# EAGLE design MainBoard_v5 (EAGLE 9.7.0)

## Sheet 1 of 3
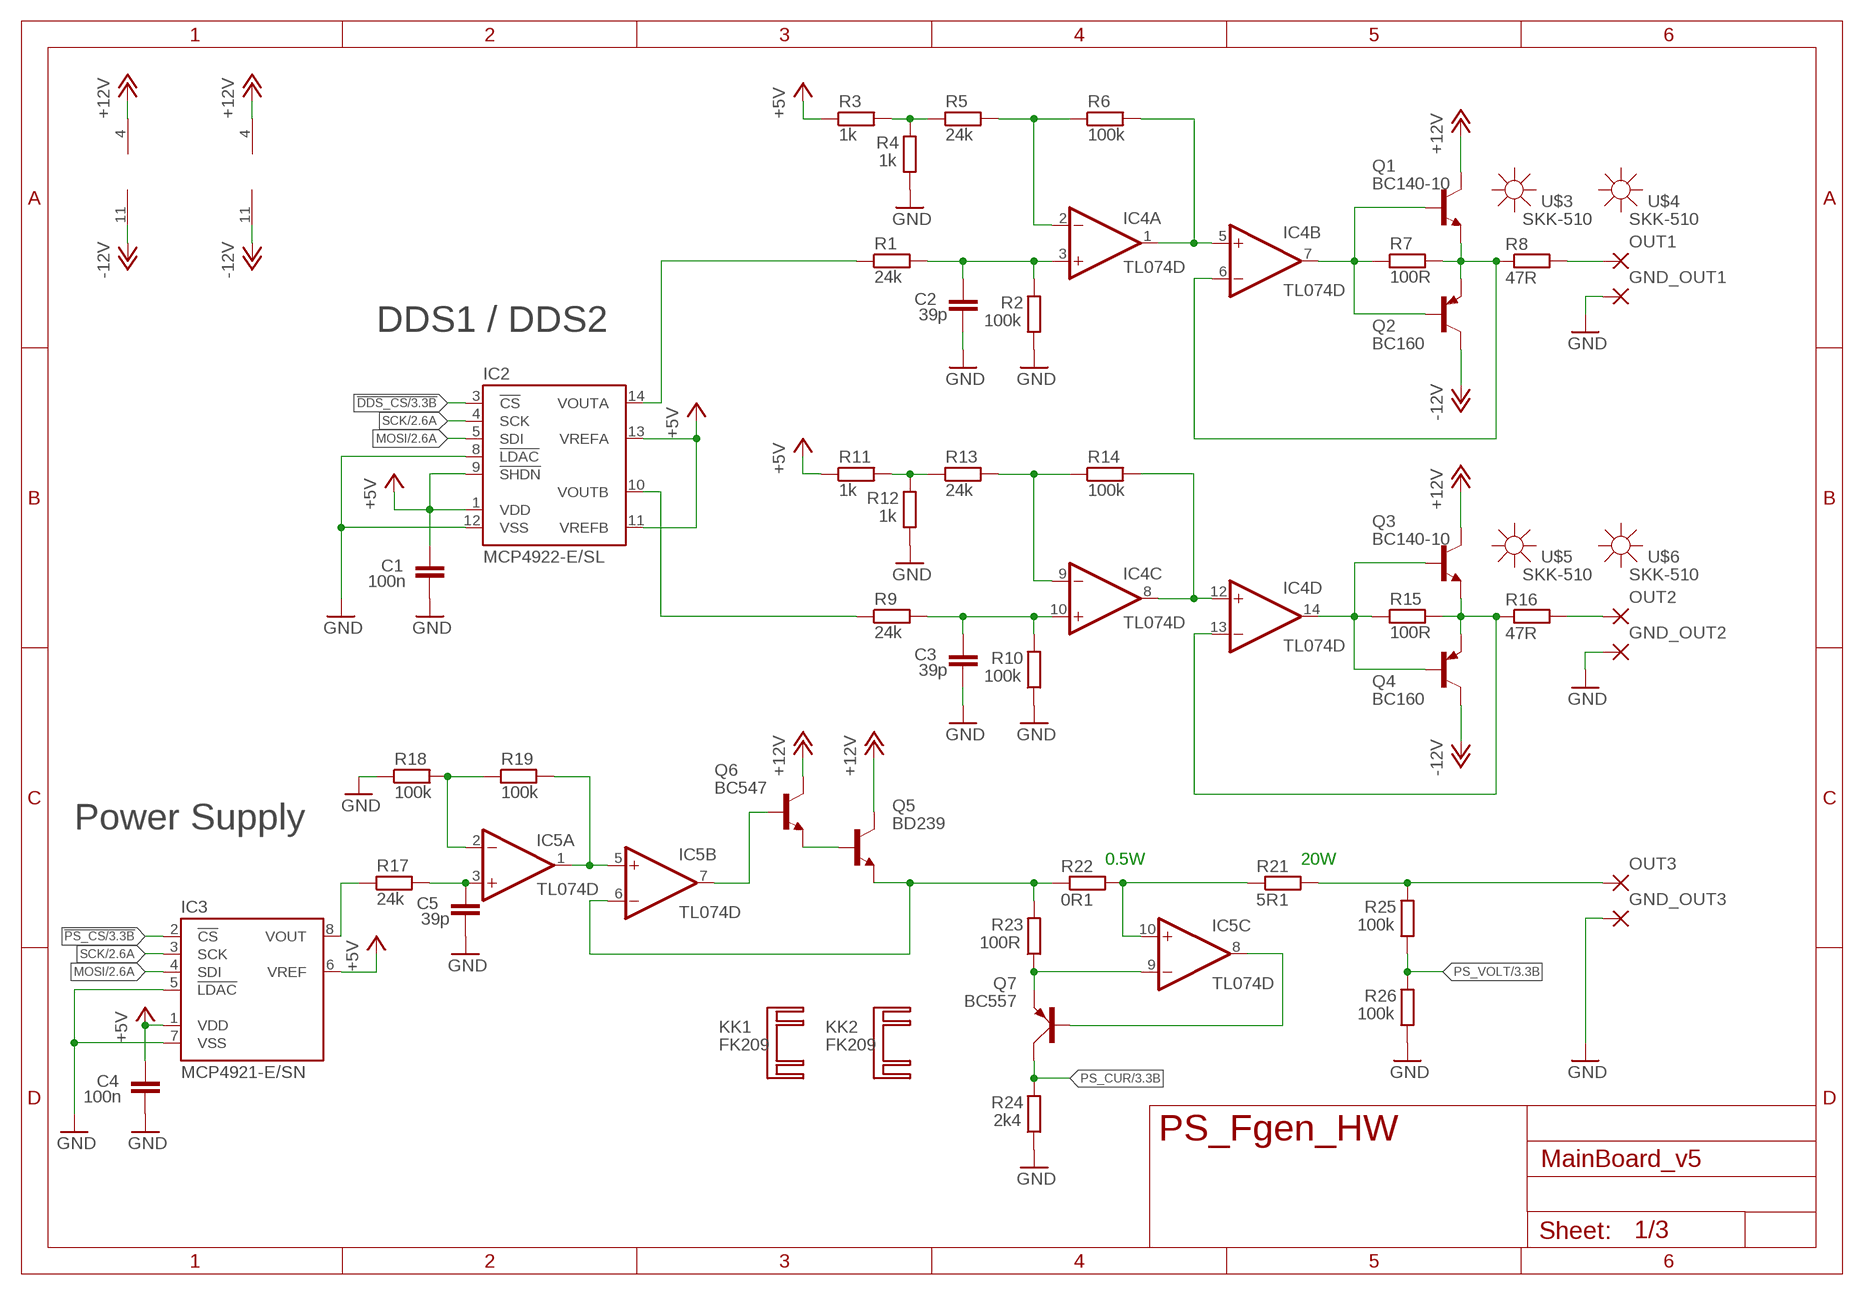
[diagram p0: schematic, sheet 1]

### Parts
C1  100n  C-EUC0805  [C0805]
C2  39p  C-EUC0805  [C0805]
C3  39p  C-EUC0805  [C0805]
C4  100n  C-EUC0805  [C0805]
C5  39p  C-EUC0805  [C0805]
GND_OUT1  2,54/1,0  [2,54/1,0]
GND_OUT2  2,54/1,0  [2,54/1,0]
GND_OUT3  2,54/1,0  [2,54/1,0]
IC2  MCP4922-E/SL  [SO14]
IC3  MCP4921-E/SN  [SO08]
IC4  TL074D  [SO14]
IC5  TL074D  [SO14]
KK1  FK209  [FK209]
KK2  FK209  [FK209]
OUT1  2,54/1,0  [2,54/1,0]
OUT2  2,54/1,0  [2,54/1,0]
OUT3  2,54/1,0  [2,54/1,0]
Q1  BC140-10  [TO39]
Q2  BC160  [TO39]
Q3  BC140-10  [TO39]
Q4  BC160  [TO39]
Q5  BD239  BD239TO220BV  [CB-274]
Q6  BC547  [TO92]
Q7  BC557  [SOT54A]
R1  24k  R-EU_R0805  [R0805]
R2  100k  R-EU_R0805  [R0805]
R3  1k  R-EU_R0805  [R0805]
R4  1k  R-EU_R0805  [R0805]
R5  24k  R-EU_R0805  [R0805]
R6  100k  R-EU_R0805  [R0805]
R7  100R  R-EU_R0805  [R0805]
R8  47R  R-EU_0411/15  [0411/15]
R9  24k  R-EU_R0805  [R0805]
R10  100k  R-EU_R0805  [R0805]
R11  1k  R-EU_R0805  [R0805]
R12  1k  R-EU_R0805  [R0805]
R13  24k  R-EU_R0805  [R0805]
R14  100k  R-EU_R0805  [R0805]
R15  100R  R-EU_R0805  [R0805]
R16  47R  R-EU_0411/15  [0411/15]
R17  24k  R-EU_R0805  [R0805]
R18  100k  R-EU_R0805  [R0805]
R19  100k  R-EU_R0805  [R0805]
R21  5R1  R-EU_0411/15  [0411/15]
R22  0R1  R-EU_0411/15  [0411/15]
R23  100R  R-EU_R0805  [R0805]
R24  2k4  R-EU_R0805  [R0805]
R25  100k  R-EU_R0805  [R0805]
R26  100k  R-EU_R0805  [R0805]
U$3  SKK-510  [SKK]
U$4  SKK-510  [SKK]
U$5  SKK-510  [SKK]
U$6  SKK-510  [SKK]

### Nets
!DDS_CS: IC2.3(!CS) ; also sheet 3
!PS_CS: IC3.2(!CS) ; also sheet 3
+5V: C1.2 C4.2 IC2.1(VDD) IC2.9(!SHDN) IC2.11(VREFB) IC2.13(VREFA) IC3.1(VDD) IC3.6(VREF) R3.1 R11.1 ; also sheet 2,3
+12V: IC4.4(P:V+) IC5.4(P:V+) Q1.3(C) Q3.3(C) Q5.T2(C) Q6.3(C) ; also sheet 2
-12V: IC4.11(P:V-) IC5.11(P:V-) Q2.3(C) Q4.3(C) ; also sheet 2
GND: C1.1 C2.1 C3.1 C4.1 C5.1 GND_OUT1.1(P) GND_OUT2.1(P) GND_OUT3.1(P) IC2.8(!LDAC) IC2.12(VSS) IC3.5(!LDAC) IC3.7(VSS) R2.1 R4.1 R10.1 R12.1 R18.1 R24.1 R26.1 ; also sheet 2,3
MOSI: IC2.5(SDI) IC3.4(SDI) ; also sheet 2,3
N$1: IC2.14(VOUTA) R1.1
N$2: C2.2 IC4.3(A:+IN) R1.2 R2.2
N$3: R3.2 R4.2 R5.1
N$4: IC4.2(A:-IN) R5.2 R6.1
N$5: IC4.7(B:OUT) Q1.2(B) Q2.2(B) R7.1
N$6: IC4.1(A:OUT) IC4.5(B:+IN) R6.2
N$7: IC4.6(B:-IN) Q1.1(E) Q2.1(E) R7.2 R8.1
N$8: R11.2 R12.2 R13.1
N$9: IC4.9(C:-IN) R13.2 R14.1
N$10: C3.2 IC4.10(C:+IN) R9.2 R10.2
N$11: IC4.8(C:OUT) IC4.12(D:+IN) R14.2
N$12: IC2.10(VOUTB) R9.1
N$13: IC4.14(D:OUT) Q3.2(B) Q4.2(B) R15.1
N$14: IC4.13(D:-IN) Q3.1(E) Q4.1(E) R15.2 R16.1
N$15: IC3.8(VOUT) R17.1
N$16: C5.2 IC5.3(A:+IN) R17.2
N$17: IC5.2(A:-IN) R18.2 R19.1
N$18: IC5.6(B:-IN) Q5.G(E) R22.1 R23.2
N$19: IC5.1(A:OUT) IC5.5(B:+IN) R19.2
N$20: Q5.T1(B) Q6.1(E)
N$22: OUT3.1(P) R21.2 R25.2
N$23: IC5.9(C:-IN) Q7.E R23.1
N$25: IC5.8(C:OUT) Q7.B
N$31: OUT2.1(P) R16.2
N$32: OUT1.1(P) R8.2
N$38: IC5.7(B:OUT) Q6.2(B)
N$39: IC5.10(C:+IN) R21.1 R22.2
PS_CUR: Q7.C R24.2 ; also sheet 3
PS_VOLT: R25.1 R26.2 ; also sheet 3
SCK: IC2.4(SCK) IC3.3(SCK) ; also sheet 2,3

### Notes on the sheet
- DDS1 / DDS2
- Power Supply
- 0.5W | 20W
- PS_Fgen_HW

## Sheet 2 of 3
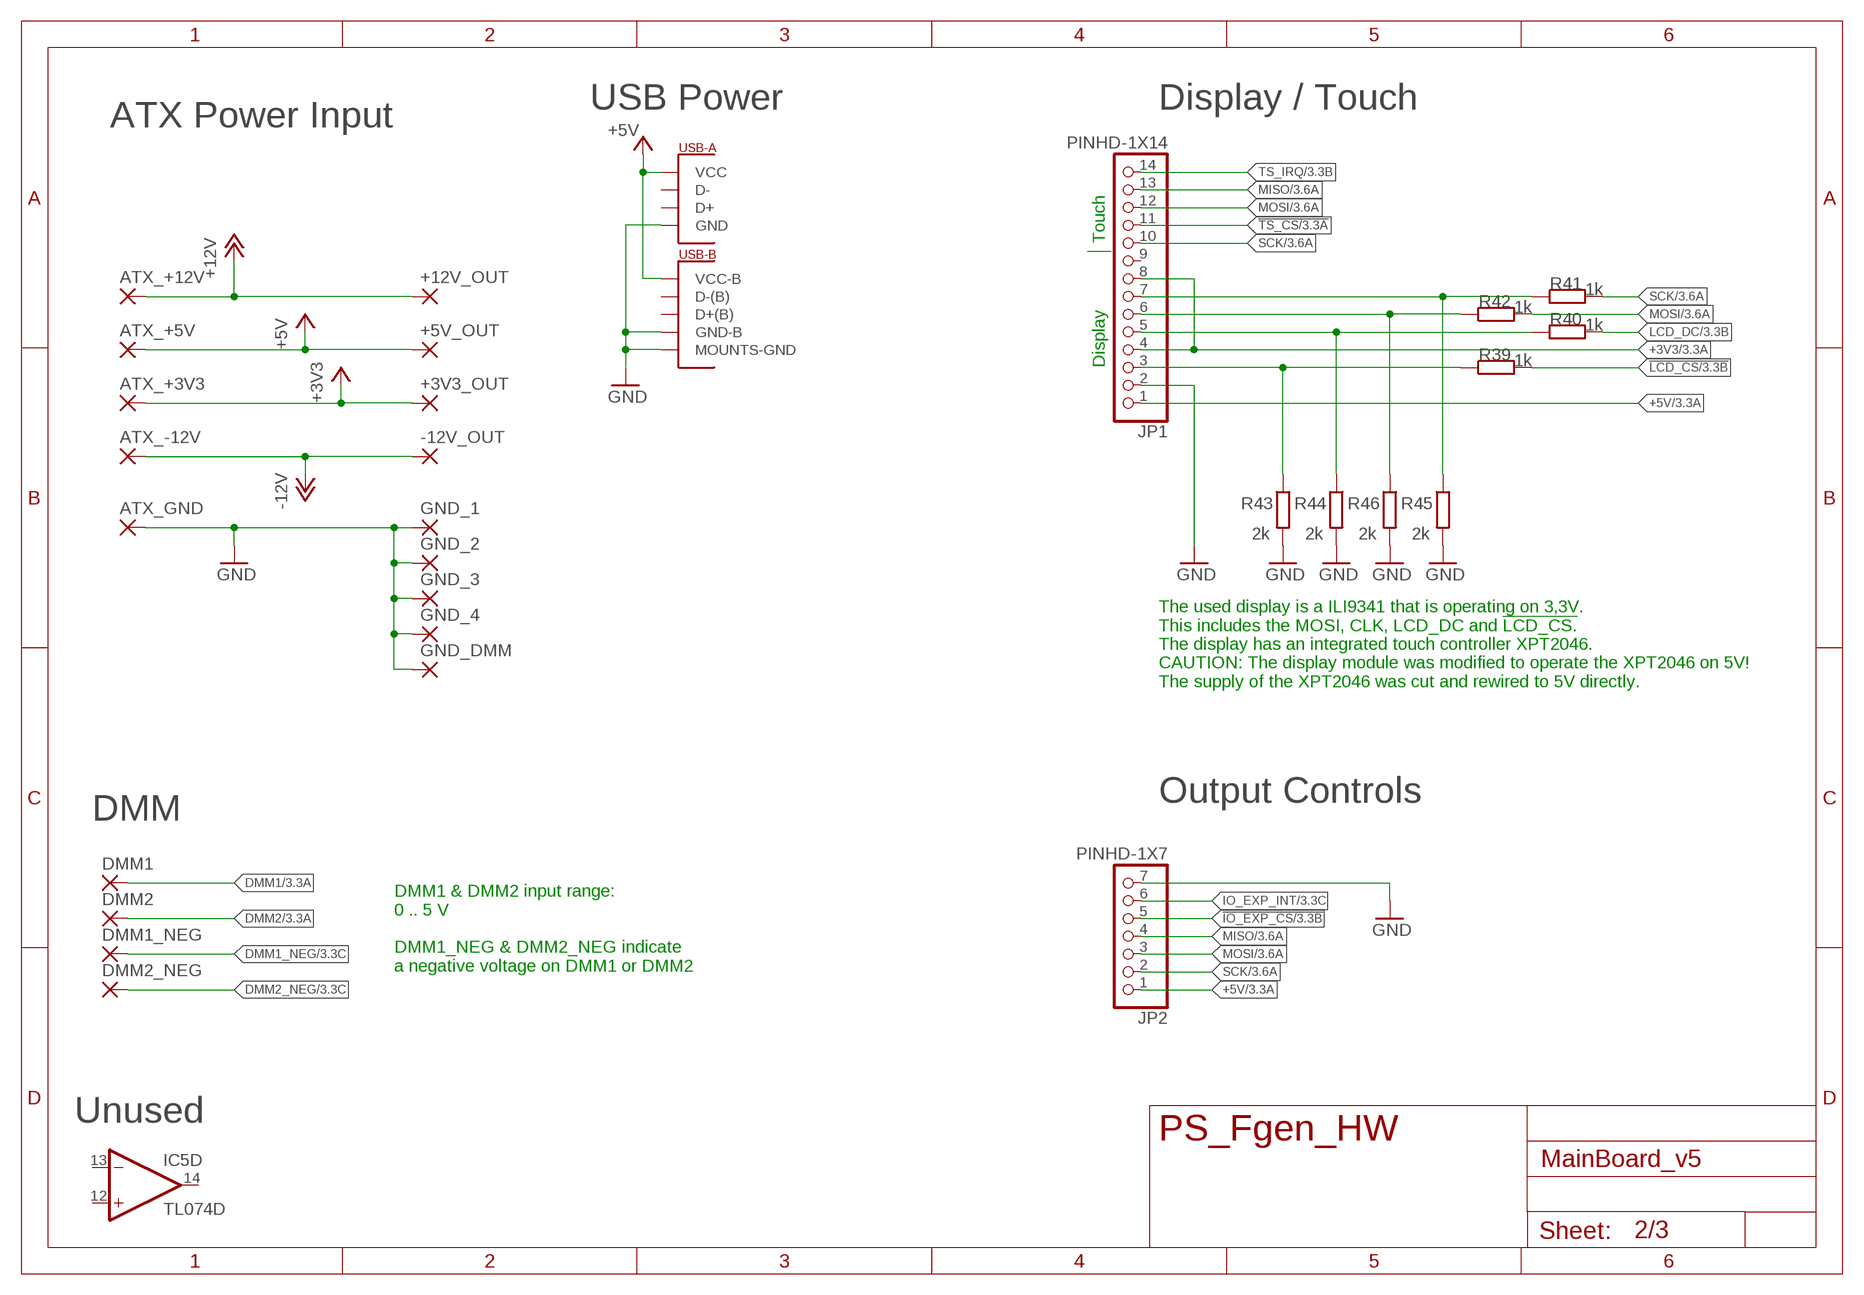
[diagram p1: schematic, sheet 2]

### Parts
+3V3_OUT  2,54/1,0  [2,54/1,0]
+5V_OUT  2,54/1,0  [2,54/1,0]
+12V_OUT  2,54/1,0  [2,54/1,0]
-12V_OUT  2,54/1,0  [2,54/1,0]
ATX_+3V3  2,54/1,0  [2,54/1,0]
ATX_+5V  2,54/1,0  [2,54/1,0]
ATX_+12V  2,54/1,0  [2,54/1,0]
ATX_-12V  2,54/1,0  [2,54/1,0]
ATX_GND  2,54/1,0  [2,54/1,0]
DMM1  2,54/1,0  [2,54/1,0]
DMM1_NEG  2,54/1,0  [2,54/1,0]
DMM2  2,54/1,0  [2,54/1,0]
DMM2_NEG  2,54/1,0  [2,54/1,0]
GND_1  2,54/1,0  [2,54/1,0]
GND_2  2,54/1,0  [2,54/1,0]
GND_3  2,54/1,0  [2,54/1,0]
GND_4  2,54/1,0  [2,54/1,0]
GND_DMM  2,54/1,0  [2,54/1,0]
JP1  PINHD-1X14  [1X14]
JP2  PINHD-1X7  [1X07]
R39  1k  R-EU_R0805  [R0805]
R40  1k  R-EU_R0805  [R0805]
R41  1k  R-EU_R0805  [R0805]
R42  1k  R-EU_R0805  [R0805]
R43  2k  R-EU_R0805  [R0805]
R44  2k  R-EU_R0805  [R0805]
R45  2k  R-EU_R0805  [R0805]
R46  2k  R-EU_R0805  [R0805]
U$2  DUAL-PORT-USB-REC  [DUAL-PORT-USB]

### Nets
!IO_EXP_CS: JP2.5 ; also sheet 3
!LCD_CS: R39.2 ; also sheet 3
!LCD_CS_3V3: JP1.3 R39.1 R43.1
!TS_CS: JP1.11 ; also sheet 3
+3V3: +3V3_OUT.1(P) ATX_+3V3.1(P) JP1.4 JP1.8 ; also sheet 3
+5V: +5V_OUT.1(P) ATX_+5V.1(P) JP1.1 JP2.1 U$2.P$10(VCC-B) U$2.P$12(VCC) ; also sheet 1,3
+12V: +12V_OUT.1(P) ATX_+12V.1(P) ; also sheet 1
-12V: -12V_OUT.1(P) ATX_-12V.1(P) ; also sheet 1
DMM1: DMM1.1(P) ; also sheet 3
DMM1_NEG: DMM1_NEG.1(P) ; also sheet 3
DMM2: DMM2.1(P) ; also sheet 3
DMM2_NEG: DMM2_NEG.1(P) ; also sheet 3
GND: ATX_GND.1(P) GND_1.1(P) GND_2.1(P) GND_3.1(P) GND_4.1(P) GND_DMM.1(P) JP1.2 JP2.7 R43.2 R44.2 R45.2 R46.2 U$2.GND(MOUNTS-GND) U$2.P$2(MOUNTS-GND) U$2.P$3(MOUNTS-GND) U$2.P$4(MOUNTS-GND) U$2.P$9(GND-B) U$2.P$11(GND) ; also sheet 1,3
IO_EXP_INT: JP2.6 ; also sheet 3
LCD_DC: R40.2 ; also sheet 3
MISO: JP1.13 JP2.4 ; also sheet 3
MOSI: JP1.12 JP2.3 R42.2 ; also sheet 1,3
MOSI_3V3: JP1.6 R42.1 R46.1
N$21: JP1.5 R40.1 R44.1
SCK: JP1.10 JP2.2 R41.2 ; also sheet 1,3
SCK_3V3: JP1.7 R41.1 R45.1
TS_IRQ: JP1.14 ; also sheet 3
Unconnected: IC5.12(D:+IN) IC5.13(D:-IN) IC5.14(D:OUT) JP1.9 U$2.P$5(D-(B)) U$2.P$6(D+(B)) U$2.P$7(D-) U$2.P$8(D+)

### Notes on the sheet
- USB Power | Display / Touch
- ATX Power Input
- Touch
- Display
- The used display is a ILI9341 that is operating on 3,3V.
  This includes the MOSI, CLK, LCD_DC and !LCD_CS.
  The display has an integrated touch controller XPT2046.
  CAUTION: The display module was modified to operate the XPT2046 on 5V!
  The supply of the XPT2046 was cut and rewired to 5V directly.
- Output Controls
- DMM
- DMM1 & DMM2 input range:
  0 .. 5 V
  
  DMM1_NEG & DMM2_NEG indicate
  a negative voltage on DMM1 or DMM2
- Unused
- PS_Fgen_HW

## Sheet 3 of 3
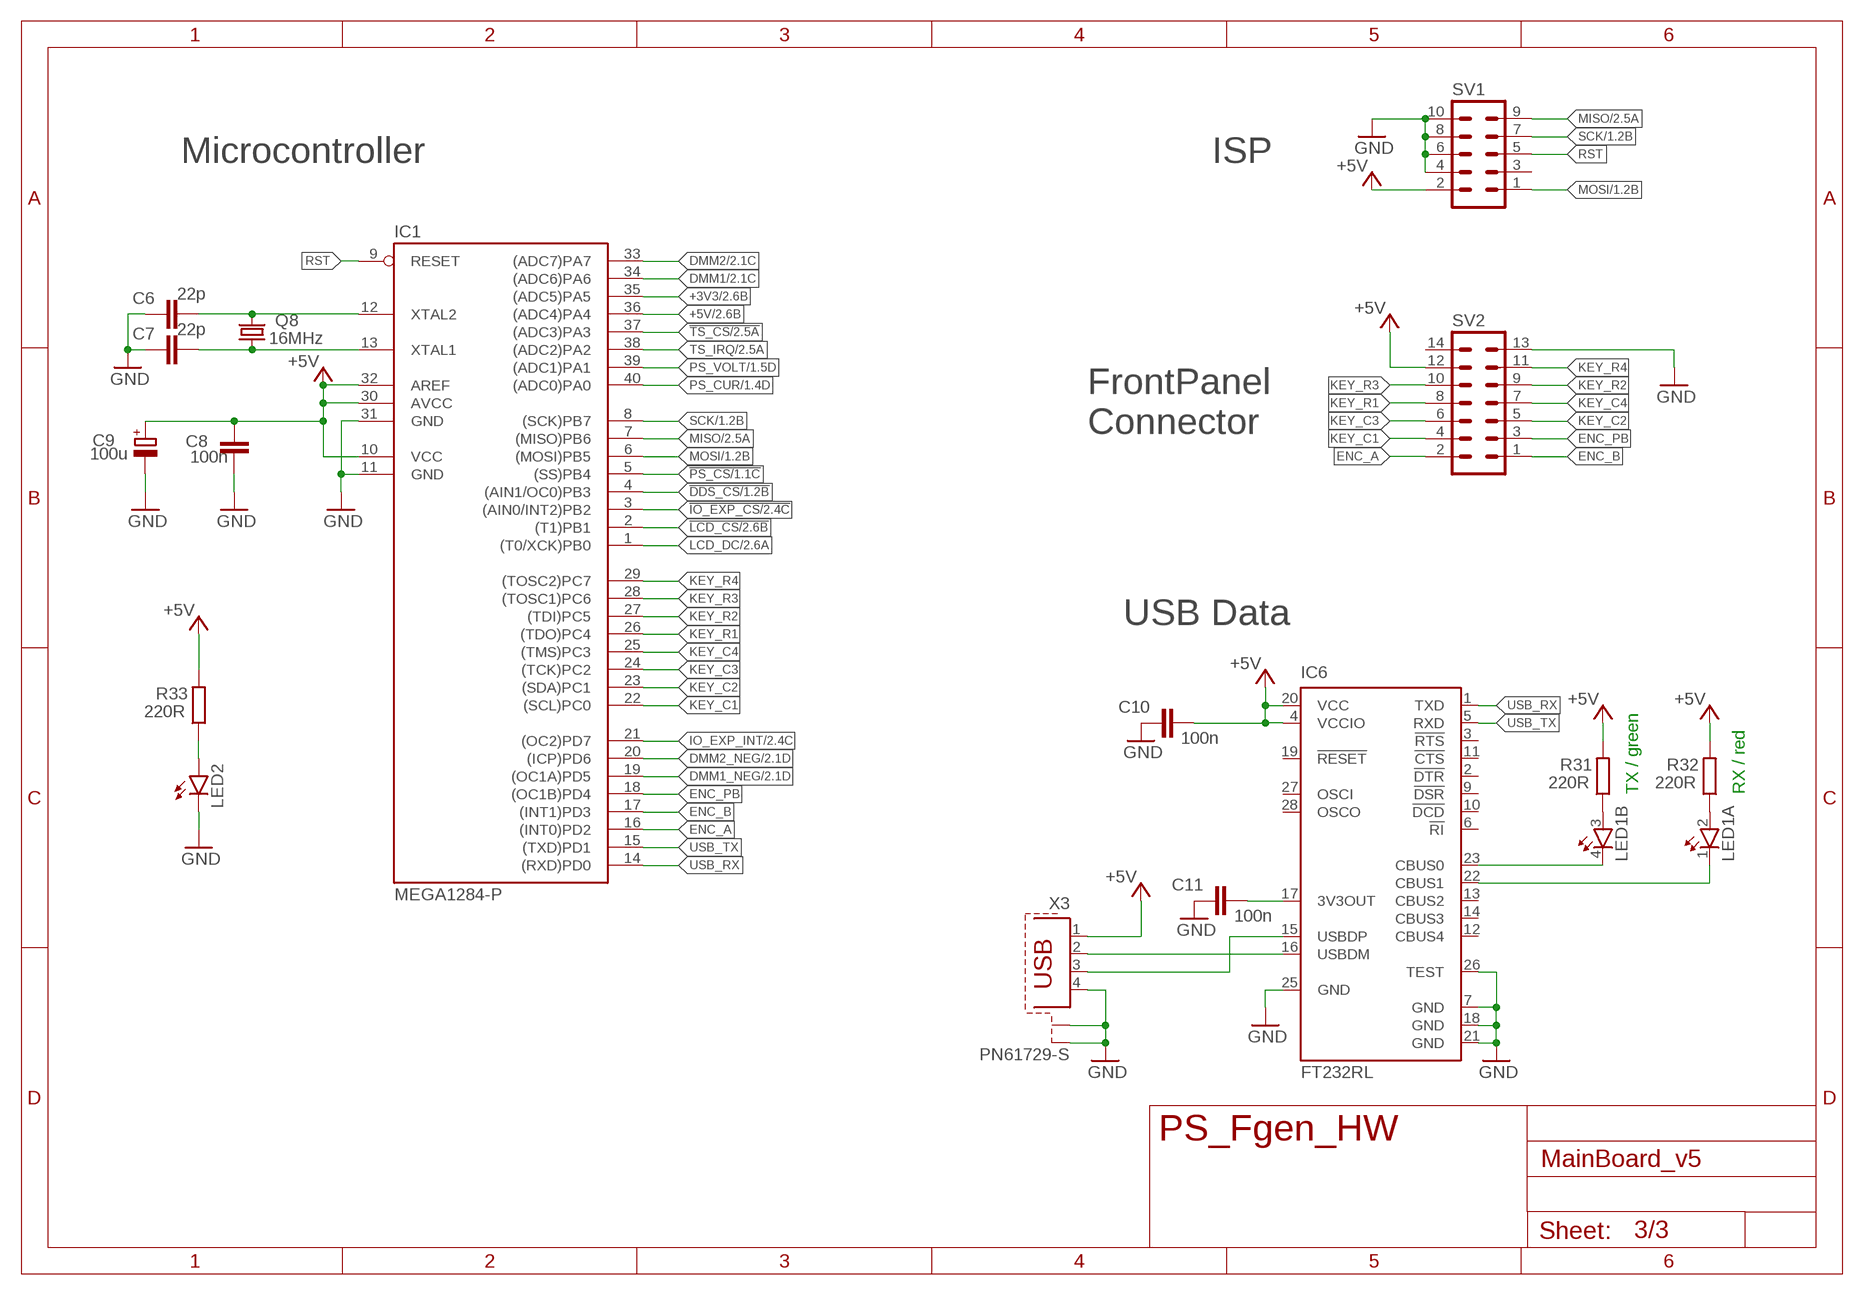
[diagram p2: schematic, sheet 3]

### Parts
C6  22p  C-EUC0805  [C0805]
C7  22p  C-EUC0805  [C0805]
C8  100n  C-EUC0805  [C0805]
C9  100u  CPOL-EUD  [PANASONIC_D]
C10  100n  C-EUC0805  [C0805]
C11  100n  C-EUC0805  [C0805]
IC1  MEGA1284-P  MEGA16-P  [DIL40]
IC6  FT232RL  [SSOP28]
LED1  TOPLED-2--  [P-LCC-4-2]
LED2  LEDCHIP-LED0805  [CHIP-LED0805]
Q8  16MHz  CRYSTALHC49S  [HC49/S]
R31  220R  R-EU_R0805  [R0805]
R32  220R  R-EU_R0805  [R0805]
R33  220R  R-EU_R0805  [R0805]
SV1  ML10  [ML10]
SV2  ML14  [ML14]
X3  PN61729-S  [PN61729-S]

### Nets
!DDS_CS: IC1.4((AIN1/OC0)PB3) ; also sheet 1
!IO_EXP_CS: IC1.3((AIN0/INT2)PB2) ; also sheet 2
!LCD_CS: IC1.2((T1)PB1) ; also sheet 2
!PS_CS: IC1.5((SS)PB4) ; also sheet 1
!TS_CS: IC1.37((ADC3)PA3) ; also sheet 2
+3V3: IC1.35((ADC5)PA5) ; also sheet 2
+5V: C8.2 C9.+ C10.1 IC1.10(VCC) IC1.30(AVCC) IC1.32(AREF) IC1.36((ADC4)PA4) IC6.4(VCCIO) IC6.20(VCC) R31.2 R32.2 R33.2 SV1.2 SV2.12 X3.1 ; also sheet 1,2
DMM1: IC1.34((ADC6)PA6) ; also sheet 2
DMM1_NEG: IC1.19((OC1A)PD5) ; also sheet 2
DMM2: IC1.33((ADC7)PA7) ; also sheet 2
DMM2_NEG: IC1.20((ICP)PD6) ; also sheet 2
ENC_A: IC1.16((INT0)PD2) SV2.2
ENC_B: IC1.17((INT1)PD3) SV2.1
ENC_PB: IC1.18((OC1B)PD4) SV2.3
GND: C6.2 C7.2 C8.1 C9.- C10.2 C11.2 IC1.11(GND) IC1.31(GND) IC6.7(GND) IC6.18(GND) IC6.21(GND) IC6.25(GND) IC6.26(TEST) LED2.C SV1.4 SV1.6 SV1.8 SV1.10 SV2.13 X3.4 X3.S1 X3.S2 ; also sheet 1,2
IO_EXP_INT: IC1.21((OC2)PD7) ; also sheet 2
KEY_C1: IC1.22((SCL)PC0) SV2.4
KEY_C2: IC1.23((SDA)PC1) SV2.5
KEY_C3: IC1.24((TCK)PC2) SV2.6
KEY_C4: IC1.25((TMS)PC3) SV2.7
KEY_R1: IC1.26((TDO)PC4) SV2.8
KEY_R2: IC1.27((TDI)PC5) SV2.9
KEY_R3: IC1.28((TOSC1)PC6) SV2.10
KEY_R4: IC1.29((TOSC2)PC7) SV2.11
LCD_DC: IC1.1((T0/XCK)PB0) ; also sheet 2
MISO: IC1.7((MISO)PB6) SV1.9 ; also sheet 2
MOSI: IC1.6((MOSI)PB5) SV1.1 ; also sheet 1,2
N$24: C7.1 IC1.13(XTAL1) Q8.1
N$26: C6.1 IC1.12(XTAL2) Q8.2
N$28: C11.1 IC6.17(3V3OUT)
N$29: IC6.16(USBDM) X3.2
N$30: IC6.15(USBDP) X3.3
N$33: IC6.23(CBUS0) LED1.4(B:C)
N$34: IC6.22(CBUS1) LED1.1(A:C)
N$35: LED1.3(B:A) R31.1
N$36: LED1.2(A:A) R32.1
N$37: LED2.A R33.1
PS_CUR: IC1.40((ADC0)PA0) ; also sheet 1
PS_VOLT: IC1.39((ADC1)PA1) ; also sheet 1
RST: IC1.9(RESET) SV1.5
SCK: IC1.8((SCK)PB7) SV1.7 ; also sheet 1,2
TS_IRQ: IC1.38((ADC2)PA2) ; also sheet 2
USB_RX: IC1.14((RXD)PD0) IC6.1(TXD)
USB_TX: IC1.15((TXD)PD1) IC6.5(RXD)
Unconnected: IC6.2(!DTR) IC6.3(!RTS) IC6.6(!RI) IC6.9(!DSR) IC6.10(!DCD) IC6.11(!CTS) IC6.12(CBUS4) IC6.13(CBUS2) IC6.14(CBUS3) IC6.19(!RESET) IC6.27(OSCI) IC6.28(OSCO) SV1.3 SV2.14

### Notes on the sheet
- Microcontroller | ISP
- FrontPanel
  Connector
- USB Data
- TX / green | RX / red
- PS_Fgen_HW

## Library data of the parts
+3V3_OUT +5V_OUT +12V_OUT -12V_OUT ATX_+3V3 ATX_+5V ATX_+12V ATX_-12V ATX_GND DMM1 DMM1_NEG DMM2 DMM2_NEG GND_1-GND_4 GND_DMM GND_OUT1-GND_OUT3 OUT1-OUT3 = OwnDevices:2,54/1,0: THROUGH-HOLE PAD
C1-C8 C10 C11 = rcl:C-EU: CAPACITOR, European symbol; SPICEPREFIX: C
C9 = rcl:CPOL-EU: POLARIZED CAPACITOR, European symbol; SPICEPREFIX: C
IC1 = atmel:MEGA16-P: MICROCONTROLLER 16 Kbytes FLASH 1 kbytes SRAM 512 bytes EEPROM USART 8-channel 10 bit ADC Source: avr.lbr; MPN: ATMEGA16-16PU; OC_FARNELL: 9171142; OC_NEWARK: 01M6885
IC2 = nh-ic:MCP4922: Microchip MCP4922 According to datasheet http://ww1.microchip.com/downloads/en/DeviceDoc/22250A.pdf. Created by Nils Hintze <n.hintze@elektronikpage.net>
IC3 = nh-ic:MCP4921: Microchip MCP4921 According to datasheet http://ww1.microchip.com/downloads/en/DeviceDoc/22248a.pdf. Created by Nils Hintze <n.hintze@elektronikpage.net>
IC4 IC5 = linear:TL074: OP AMP
IC6 = ftdichip:FT232R: Source: http://www.ftdichip.com/Documents/DataSheets/DS_FT232R_v104.pdf; MPN: FT232RL; OC_FARNELL: 1146032; OC_NEWARK: 91K9918
JP1 = Connector:PINHD-1X14: PIN HEADER; CATEGORY: Headers; DESCRIPTION: Header-Straight-14 Position; PACKAGE_TYPE: THT; PITCH: 0.100" (2.54mm); SUBCATEGORY: Headers-Male Pins; TYPE: Board to Board or Cable-Unshrouded-Through Hole-Straight
JP2 = Connector:PINHD-1X7: PIN HEADER; CATEGORY: Headers; DESCRIPTION: Header-Straight-7 Position; PACKAGE_TYPE: THT; PITCH: 0.100" (2.54mm); SUBCATEGORY: Headers-Male Pins; TYPE: Board to Board or Cable-Unshrouded-Through Hole-Straight
KK1 KK2 = heatsink:FK209: HEATSINK manufacturer Fischer/distributor Buerklin
LED1 = led:TOPLED-2-: Multi TOPLED® (two color) LG T672, LP T672 LSY T67B LSW T67C LSY T675 LSY T676 LSG T677 LSG T770 Source: http://www.osram.convergy.de/
LED2 = led:LED: LED OSRAM: - CHIPLED LG R971, LG N971, LY N971, LG Q971, LY Q971, LO R971, LY R971 LH N974, LH R974 LS Q976, LO Q976, LY Q976 LO Q996 - Hyper CHIPLED LW Q18S LB Q993, LB Q99A, LB R99A - SideLED LS A670, LO A670, LY A670, LG A670, LP A670 LB A673, LV A673, LT A673, LW A673 LH A674 LY A675 LS A676, LA A676, LO A676, LY A676, LW A676 LS A679, LY A679, LG A679 - Hyper Micro SIDELED® LS Y876, LA Y876, LO Y876, LY Y876 LT Y87S - SmartLED LW L88C, LW L88S LB L89C, LB L89S, LG L890 LS L89K, LO L89K, LY L89K LS L896, LA L896, LO L896, LY L896 - TOPLED LS T670, LO T670, LY T670, LG T670, LP T670 LSG T670, LSP T670, LSY T670, LOP T670, LYG T670 LG T671, LOG T671, LSG T671 LB T673, LV T673, LT T673, LW T673 LH T674 LS T676, LA T676, LO T676, LY T676, LB T676, LH T676, LSB T676, LW T676 LB T67C, LV T67C, LT T67C, LS T67K, LO T67K, LY T67K, LW E67C LS E67B, LA E67B, LO E67B, LY E67B, LB E67C, LV E67C, LT E67C LW T67C LS T679, LY T679, LG T679 LS T770, LO T770, LY T770, LG T770, LP T770 LB T773, LV T773, LT T773, LW T773 LH T774 LS E675, LA E675, LY E675, LS T675 LS T776, LA T776, LO T776, LY T776, LB T776 LHGB T686 LT T68C, LB T68C - Hyper Mini TOPLED® LB M676 - Mini TOPLED Santana® LG M470 LS M47K, LO M47K, LY M47K Source: http://www.osram.convergy.de LUXEON: - LUMILED® LXK2-PW12-R00, LXK2-PW12-S00, LXK2-PW14-U00, LXK2-PW14-V00 LXK2-PM12-R00, LXK2-PM12-S00, LXK2-PM14-U00 LXK2-PE12-Q00, LXK2-PE12-R00, LXK2-PE12-S00, LXK2-PE14-T00, LXK2-PE14-U00 LXK2-PB12-K00, LXK2-PB12-L00, LXK2-PB12-M00, LXK2-PB14-N00, LXK2-PB14-P00, LXK2-PB14-Q00 LXK2-PR12-L00, LXK2-PR12-M00, LXK2-PR14-Q00, LXK2-PR14-R00 LXK2-PD12-Q00, LXK2-PD12-R00, LXK2-PD12-S00 LXK2-PH12-R00, LXK2-PH12-S00 LXK2-PL12-P00, LXK2-PL12-Q00, LXK2-PL12-R00 Source: www.luxeon.com KINGBRIGHT: KA-3528ASYC Source: www.kingbright.com
Q1 Q3 = transistor-npn:BC140-10: NPN Transistor
Q2 Q4 = transistor-pnp:BC160*: PNP Transistror
Q5 = OwnDevices:BD239*: NPN Transistor
Q6 = transistor:BC547: NPN TRANSISTOR
Q7 = transistor-small-signal:BC557: PNP TRANSISTOR
Q8 = crystal:CRYSTAL: CRYSTAL; OC_FARNELL: 1667008; OC_NEWARK: unknown
R1-R19 R21-R26 R31-R33 R39-R46 = OwnDevices:R-EU_: RESISTOR, European symbol; SPICEPREFIX: R
SV1 = con-harting-ml:ML10: HARTING; OC_FARNELL: unknown; OC_NEWARK: unknown
SV2 = con-harting-ml:ML14: HARTING; OC_FARNELL: unknown; OC_NEWARK: unknown
U$2 = tps2511:DUAL-PORT-USB-REC: Dual USB Receptacle, Horizontal.
U$3-U$6 = OwnDevices:SKK-510: Kühlkörper Fischer SKK-510
X3 = con-berg:PN61729-S: BERG USB connector; OC_FARNELL: unknown; OC_NEWARK: unknown

## Board
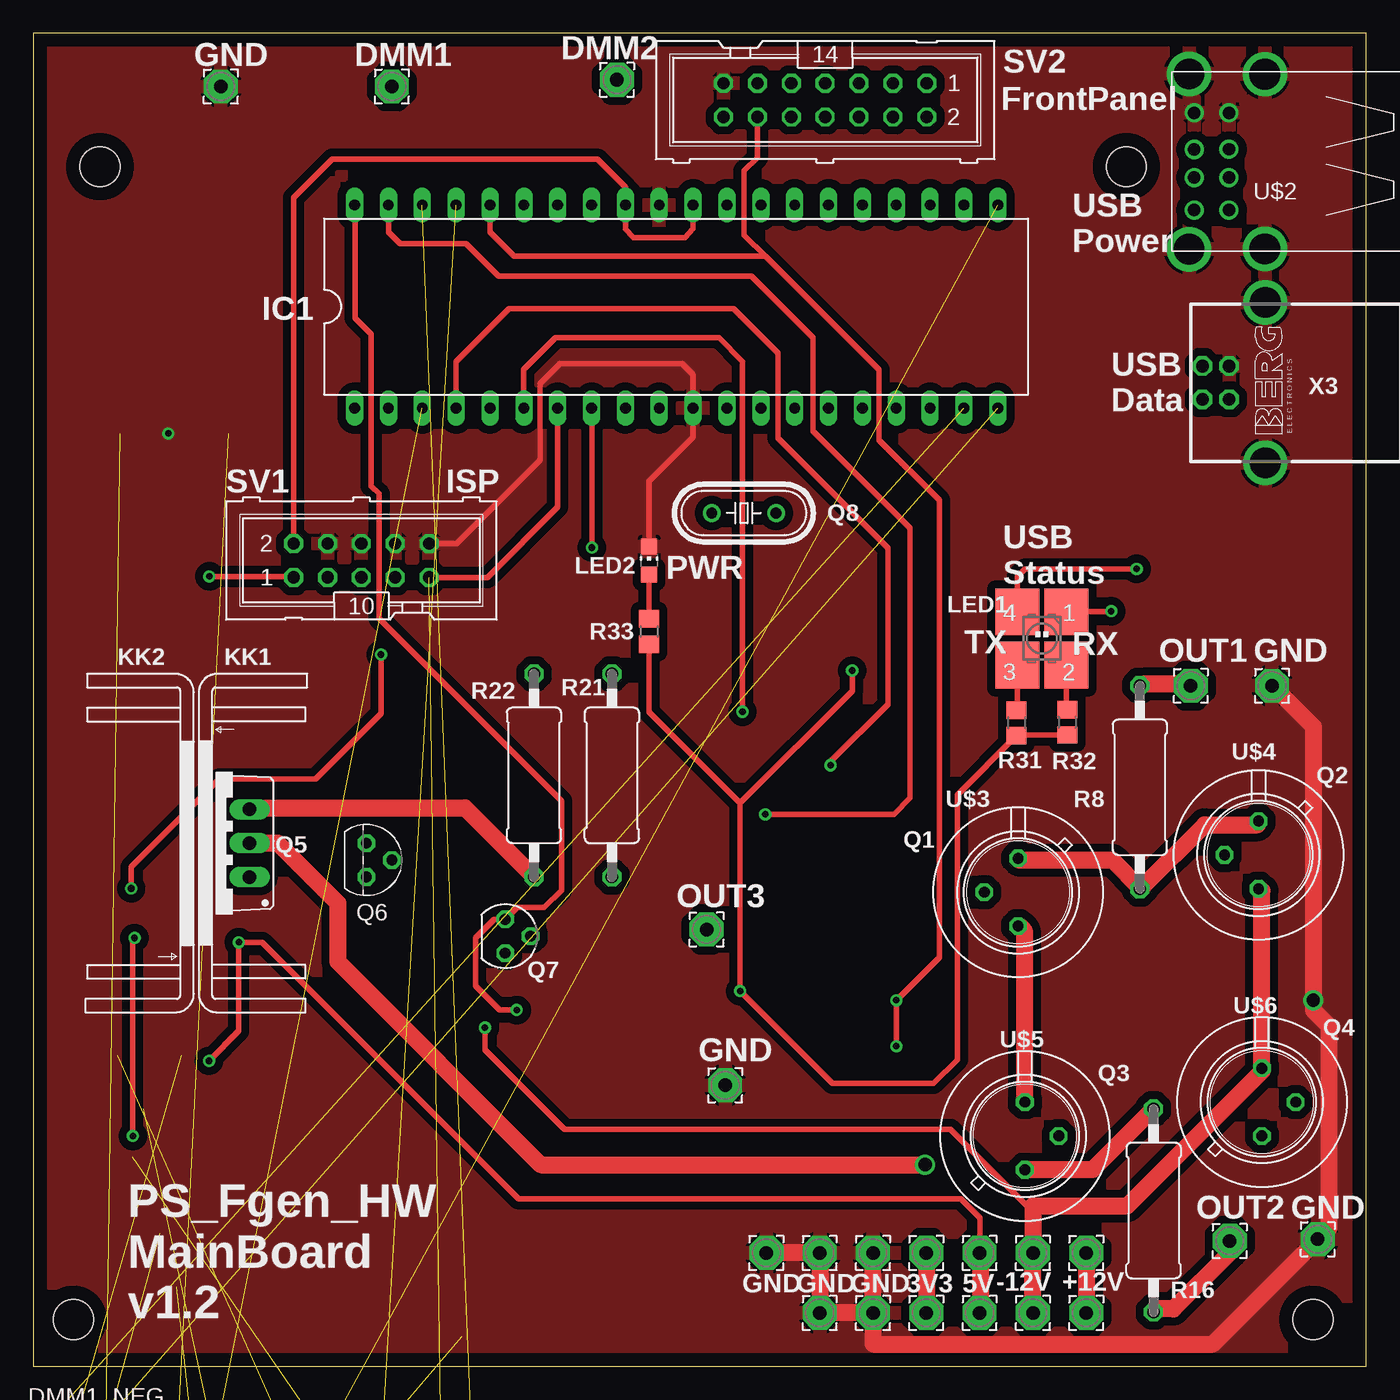
[diagram p3: board, top side]
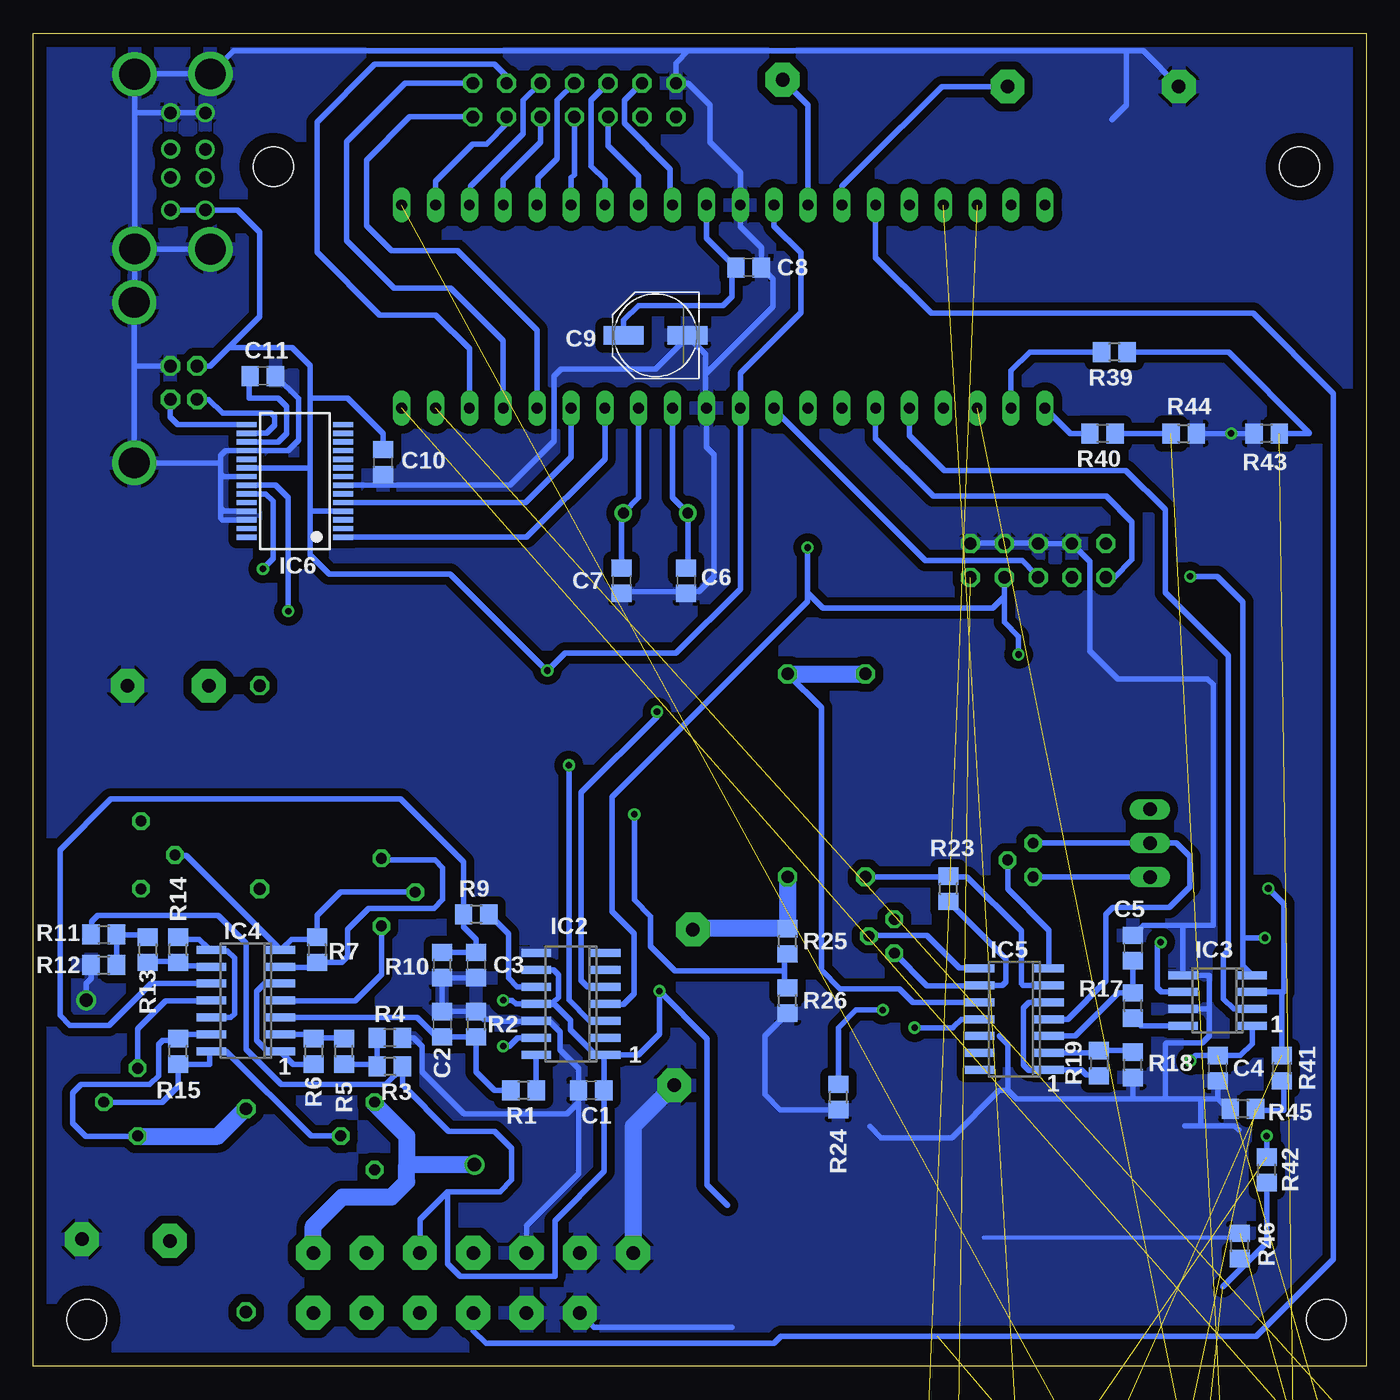
[diagram p4: board, bottom side, seen from below]

Size 100 x 100 mm. Coordinates in mm from the lower left corner, seen from the top.
Outline: 0,0 100,0 100,100 0,100 0,0
Copper layers (1*16): Top 0.035mm / dielectric 1.5mm / Bottom 0.035mm
Design rules "Fusion Electronics Design Rules": minimum track width 10mil, minimum drill 0.5mm, track to track 6mil, track to pad 6mil, pad to pad 6mil, via to via 6mil, smd to smd 6mil, copper to edge 40mil, drill to drill 8mil, minimum pad ring 10mil, minimum via ring 8mil, stop-mask expansion 4mil, vias tented up to drill 0mil, thermal gap 10mil
Holes 3 mm at 82,90 5,90 3,3.5 96,3.5

### Footprints (pad centres in the part's own frame; a part is rotated, then mirrored left to right if it is on the bottom)
2,54/1,0 = drill 1.016 pad 2.54 octagon: 1 0,0
C0805 = smd 1.3 x 1.5: 1 -0.95,0; 2 0.95,0
PANASONIC_D = smd 3 x 1.4: + 2.4,0; - -2.4,0
DIL40 = drill 0.813 long: 1 -24.13,-7.62; 2 -21.59,-7.62; 3 -19.05,-7.62; 4 -16.51,-7.62; 5 -13.97,-7.62; 6 -11.43,-7.62; 7 -8.89,-7.62; 8 -6.35,-7.62; 9 -3.81,-7.62; 10 -1.27,-7.62; 11 1.27,-7.62; 12 3.81,-7.62; 13 6.35,-7.62; 14 8.89,-7.62; 15 11.43,-7.62; 16 13.97,-7.62; 17 16.51,-7.62; 18 19.05,-7.62; 19 21.59,-7.62; 20 24.13,-7.62; 21 24.13,7.62; 22 21.59,7.62; 23 19.05,7.62; 24 16.51,7.62; 25 13.97,7.62; 26 11.43,7.62; 27 8.89,7.62; 28 6.35,7.62; 29 3.81,7.62; 30 1.27,7.62; 31 -1.27,7.62; 32 -3.81,7.62; 33 -6.35,7.62; 34 -8.89,7.62; 35 -11.43,7.62; 36 -13.97,7.62; 37 -16.51,7.62; 38 -19.05,7.62; 39 -21.59,7.62; 40 -24.13,7.62
SO14 = smd 0.6 x 2.2: 1 -3.81,-2.6; 2 -2.54,-2.6; 3 -1.27,-2.6; 4 0,-2.6; 5 1.27,-2.6; 6 2.54,-2.6; 7 3.81,-2.6; 8 3.81,2.6; 9 2.54,2.6; 10 1.27,2.6; 11 0,2.6; 12 -1.27,2.6; 13 -2.54,2.6; 14 -3.81,2.6
SO08 = smd 0.6 x 2.2: 1 -1.905,-2.6; 2 -0.635,-2.6; 3 0.635,-2.6; 4 1.905,-2.6; 5 1.905,2.6; 6 0.635,2.6; 7 -0.635,2.6; 8 -1.905,2.6
SSOP28 = smd 0.4 x 1.5: 1 -4.225,-3.625; 2 -3.575,-3.625; 3 -2.925,-3.625; 4 -2.275,-3.625; 5 -1.625,-3.625; 6 -0.975,-3.625; 7 -0.325,-3.625; 8 0.325,-3.625; 9 0.975,-3.625; 10 1.625,-3.625; 11 2.275,-3.625; 12 2.925,-3.625; 13 3.575,-3.625; 14 4.225,-3.625; 15 4.225,3.625; 16 3.575,3.625; 17 2.925,3.625; 18 2.275,3.625; 19 1.625,3.625; 20 0.975,3.625; 21 0.325,3.625; 22 -0.325,3.625; 23 -0.975,3.625; 24 -1.625,3.625; 25 -2.275,3.625; 26 -2.925,3.625; 27 -3.575,3.625; 28 -4.225,3.625
1X14 = drill 1.016 long: 1 -16.51,0; 2 -13.97,0; 3 -11.43,0; 4 -8.89,0; 5 -6.35,0; 6 -3.81,0; 7 -1.27,0; 8 1.27,0; 9 3.81,0; 10 6.35,0; 11 8.89,0; 12 11.43,0; 13 13.97,0; 14 16.51,0
1X07 = drill 1.016 long: 1 -7.62,0; 2 -5.08,0; 3 -2.54,0; 4 0,0; 5 2.54,0; 6 5.08,0; 7 7.62,0
P-LCC-4-2 = smd 3.3 x 3.5: 1 -1.85,-2; 2 -1.85,2; 3 1.85,2; 4 1.85,-2
CHIP-LED0805 = smd 1.2 x 1.2: A 0,-1.05; C 0,1.05
TO39 = drill 0.813 octagon: 1 0,-2.54; 2 2.54,0; 3 0,2.54
CB-274 = drill 1.016 long: G 2.54,-2.54; T1 -2.54,-2.54; T2 0,-2.54
TO92 = drill 0.813 octagon: 1 1.27,0; 2 0,1.905; 3 -1.27,0
SOT54A = drill 0.813 octagon: B 0,1.905; C -1.27,0; E 1.27,0
HC49/S = drill 0.813: 1 -2.413,0; 2 2.413,0
R0805 = smd 1.3 x 1.5: 1 -0.95,0; 2 0.95,0
0411/15 = drill 0.914 octagon: 1 -7.62,0; 2 7.62,0
ML10 = drill 0.914 octagon: 1 -5.08,-1.27; 2 -5.08,1.27; 3 -2.54,-1.27; 4 -2.54,1.27; 5 0,-1.27; 6 0,1.27; 7 2.54,-1.27; 8 2.54,1.27; 9 5.08,-1.27; 10 5.08,1.27
ML14 = drill 0.914 octagon: 1 -7.62,-1.27; 2 -7.62,1.27; 3 -5.08,-1.27; 4 -5.08,1.27; 5 -2.54,-1.27; 6 -2.54,1.27; 7 0,-1.27; 8 0,1.27; 9 2.54,-1.27; 10 2.54,1.27; 11 5.08,-1.27; 12 5.08,1.27; 13 7.62,-1.27; 14 7.62,1.27
DUAL-PORT-USB = drill 2.311: GND -7.645,0.127; P$2 -7.62,-5.563; P$3 5.512,0.127; P$4 5.486,-5.563 | drill 0.92: P$5 -2.261,-2.87; P$6 -0.127,-2.87; P$7 -2.261,-0.254; P$8 -0.152,-0.254; P$9 2.591,-2.87; P$10 -4.699,-2.87; P$11 2.591,-0.254; P$12 -4.699,-0.254
PN61729-S = drill 0.95 octagon: 1 1.25,4.71; 2 -1.25,4.71; 3 -1.25,2.71; 4 1.25,2.71 | drill 2.3 pad 2.9: S1 -6.02,0; S2 6.02,0

### Placement (x,y rotation side)
+3V3_OUT  67,4 0 top
+5V_OUT  71,4 0 top
+12V_OUT  79,4 0 top
-12V_OUT  75,4 0 top
ATX_+3V3  67,8.5 0 top
ATX_+5V  71,8.5 0 top
ATX_+12V  79,8.5 0 top
ATX_-12V  75,8.5 0 top
ATX_GND  63,8.5 0 top
C1  58.14,20.7 0 bottom
C2  69.31,25.65 270 bottom
C3  66.77,30.1 90 bottom
C4  11.15,22.35 90 bottom
C5  17.5,31.37 270 bottom
C6  51.03,58.93 270 bottom
C7  55.85,58.93 270 bottom
C8  46.33,82.42 180 bottom
C9  53.31,77.34 180 bottom
C10  73.76,67.82 270 bottom
C11  82.78,74.3 0 bottom
DMM1  26.9,96.01 0 top
DMM1_NEG  0.86,-4.45 0 top  (outside the outline)
DMM2  43.79,96.52 0 top
DMM2_NEG  0.86,-9.27 0 top  (outside the outline)
GND_1  63,4 0 top
GND_2  59,8.5 0 top
GND_3  59,4 0 top
GND_4  55,8.5 0 top
GND_DMM  14.07,96.01 0 top
GND_OUT1  92.94,51.05 0 top
GND_OUT2  96.36,9.53 0 top
GND_OUT3  51.92,21.08 0 top
IC1  48.23,79.5 0 top
IC2  59.66,27.18 90 bottom
IC3  11.15,27.43 90 bottom
IC4  84.05,27.43 90 bottom
IC5  26.39,26.04 90 bottom
IC6  80.36,66.42 90 bottom
JP1  16.74,-14.35 0 top  (outside the outline)
JP2  7.85,-21.72 0 top  (outside the outline)
KK1  13.43,39.24 270 top
KK2  11.02,39.24 90 top
LED1  75.66,54.61 180 top
LED2  46.2,60.45 0 top
OUT1  86.84,51.05 0 top
OUT2  89.76,9.4 0 top
OUT3  50.52,32.77 0 top
Q1  73.89,35.56 180 top
Q2  91.92,38.35 180 top
Q3  74.39,17.27 0 top
Q4  92.17,19.81 0 top
Q5  13.69,39.24 90 top
Q6  24.99,37.97 270 top
Q7  35.41,32.26 270 top
Q8  53.31,64.01 180 top
R1  63.22,20.7 180 bottom
R2  66.77,25.65 270 bottom
R3  73.25,22.48 180 bottom
R4  73.25,24.64 180 bottom
R5  76.68,23.62 90 bottom
R6  78.97,23.62 270 bottom
R7  78.71,31.24 270 bottom
R8  83.03,43.43 90 top
R9  66.77,33.91 180 bottom
R10  69.31,30.1 90 bottom
R11  94.71,32.38 0 bottom
R12  94.71,30.1 0 bottom
R13  91.41,31.24 270 bottom
R14  89.13,31.24 90 bottom
R15  89.13,23.62 90 bottom
R16  84.05,11.68 270 top
R17  17.5,27.05 90 bottom
R18  17.5,22.61 90 bottom
R19  20.04,22.73 270 bottom
R21  43.41,44.32 270 top
R22  37.56,44.32 90 top
R23  31.34,35.81 90 bottom
R24  39.6,20.19 90 bottom
R25  43.41,31.88 90 bottom
R26  43.41,27.43 90 bottom
R31  73.76,48.26 270 top
R32  77.57,48.31 270 top
R33  46.2,55.12 270 top
R39  18.9,76.07 180 bottom
R40  19.78,69.98 180 bottom
R41  6.32,22.35 90 bottom
R42  7.47,14.73 90 bottom
R43  7.47,69.98 180 bottom
R44  13.69,69.98 0 bottom
R45  9.24,19.3 180 bottom
R46  9.5,9.02 90 bottom
SV1  24.61,60.45 0 top
SV2  59.41,95 180 top
U$2  86.84,91.44 90 top
U$3  73.89,35.56 0 top
U$4  91.92,38.35 0 top
U$5  74.39,17.27 0 top
U$6  92.17,19.81 0 top
X3  92.43,73.79 90 top

### Tracks (layer width: path | path; a pad name or v marks a point on that pad's centre or on a via)
!DDS_CS  (via drill 0.5)
  Top 0.406: v59.81,45.09 59.81,45.36 64.11,49.66 64.11,61.39 55.85,69.65 55.85,76.02 52.53,79.35 35.68,79.35 31.72,75.39 IC1.4
  Bottom 0.406: v59.81,45.09 59.81,27.48 58.29,25.96 57.09,25.96 IC2.3
!IO_EXP_CS  (1 unrouted)
!LCD_CS
  Bottom 0.406: IC1.2 26.64,74.68 25.24,76.07 R39.2
!LCD_CS_3V3  (1 unrouted)
  Bottom 0.406: R43.1 4.29,69.98 4.26,70.01 10.33,76.07 R39.1
!PS_CS
  Bottom 0.406: IC3.2 9.95,26.8 10.71,27.56 10.71,30.86 10.36,31.21 10.36,53.31 15.09,58.04 15.09,64.26 18.03,67.21 31.65,67.21 34.26,69.83 IC1.5
!TS_CS  (1 unrouted)
+3V3  (2 unrouted)
  Top 1.016: ATX_+3V3.1 | +3V3_OUT.1
  Top 1.27: ATX_+3V3.1 +3V3_OUT.1
  Bottom 0.406: +3V3_OUT.1 67,2.66 66.04,1.7 44.44,1.7 43.9,2.23 31.72,2.23 | IC1.35 36.8,83.19 32.61,78.99 8.48,78.99 2.46,72.97 2.46,8 8.23,2.23 31.72,2.23 | 32.15,2.23 31.72,2.23
+5V  (via drill 0.5)  (2 unrouted)
  Top 0.406: v64.74,24 v64.74,27.46 67.97,30.68 67.97,64.97 63.45,69.49 63.45,74.75 54.92,83.27 | v13.18,22.91 15.41,25.15 v15.41,31.8 17.17,31.8 36.42,12.55 69.59,12.55 71,11.14 ATX_+5V.1 | SV2.12 54.33,90.68 53.34,89.69 53.34,84.86 54.92,83.27 | IC1.36 34.26,85.09 36.08,83.27 54.92,83.27 | IC1.30 49.5,85.34 48.9,84.68 45.04,84.68 44.42,85.3 IC1.32 44.42,88.44 42.31,90.55 22.43,90.55 19.53,87.66 SV1.2 | 53.03,42.27 v53.03,28.14 59.97,21.21 67.54,21.21 69.31,22.99 69.31,42.87 R31.2 73.81,47.36 R32.2 | 53.03,42.27 61.44,50.67 v61.44,52.2 | 53.03,42.27 46.2,49.1 R33.2
  Top 1.016: ATX_+5V.1 71.07,8.43 | +5V_OUT.1 71.07,4.07
  Top 1.27: 71.07,8.43 71.07,4.07
  Bottom 0.406: v64.74,24 64.29,24 63.66,24.64 IC2.13 | v64.74,27.46 64.06,27.46 63.79,27.18 IC2.11 62.24,27.15 60.88,27.15 | IC2.9 60.96,29.72 60.6,29.36 60.6,27.69 61.01,27.28 60.88,27.15 | 57.17,23.44 57.91,23.44 59.69,25.22 59.69,25.96 60.88,27.15 | 57.17,23.44 IC2.1 | IC3.6 15.36,28.07 15.67,28.37 15.67,31.55 v15.41,31.8 | R11.1 95.63,32.39 95.63,33.35 95.17,33.81 86.13,33.81 84.05,31.73 84.05,23.77 81.4,21.13 73.56,21.13 72.3,22.39 R3.1 72.3,21.1 68.83,17.63 65.38,17.63 64.11,16.36 64.11,13.97 65,13.08 68.93,13.08 | 68.93,13.08 68.93,7.7 67.99,6.76 60.87,6.76 60.87,10.92 57.19,14.61 C1.2 57.19,23.43 | 57.19,23.43 57.17,23.44 | ATX_+5V.1 71,11.01 68.93,13.08 | v13.18,22.91 12.79,23.3 C4.2 9.44,23.3 8.55,24.19 IC3.1 | U$2.P$10 U$2.P$12 84.68,86.74 83.03,85.09 83.03,78.74 85.34,76.43 | IC1.32 44.42,85.55 42.42,83.54 42.42,79.05 46.96,74.5 IC1.10 46.96,58.32 51.79,53.49 60.09,53.49 61.44,52.15 | IC1.30 49.5,84.65 C8.2 47.6,82.22 47.6,80.24 48.26,79.58 54.61,79.58 55.71,78.47 C9.+ | X3.1 86.73,75.04 85.34,76.43 | 79.25,72.64 79.25,75.08 80.6,76.43 85.34,76.43 | 79.25,72.64 76.43,72.64 73.76,69.98 C10.1 | 47.92,12.06 49.44,13.59 49.44,24.55 v53.03,28.14 53.03,24.92 54.58,23.37 57.13,23.37 57.19,23.43 | 79.25,64.14 79.25,60.86 77.82,59.44 68.73,59.44 61.44,52.15 | 79.25,64.14 79.25,67.44 | 79.25,67.44 79.25,72.64 | v61.44,52.2 61.44,52.15 | IC6.4 79.23,64.15 79.25,64.14 | IC6.20 79.29,67.4 79.25,67.44
+12V  (via drill 1)
  Top 0.406: 74.34,19.81 Q3.3
  Top 1.27: 74.34,19.81 74.34,32.69 74.01,33.02 Q1.3 | Q5.T2 18.34,39.24 22.83,34.75 22.83,30.35 38.07,15.11 v66.9,15.11 | ATX_+12V.1 +12V_OUT.1
  Bottom 0.406: Q1.3 73.89,29.39 75.87,27.41 81.28,27.41 IC4.4 | IC5.4 22.39,26.04 19.53,28.9 19.53,33.91 19.02,34.42 14.77,34.42 13.23,35.96 13.23,38.23 14.25,39.24 Q5.T2 | Q5.T2 14.32,39.24 | Q6.3 Q5.T2
  Bottom 1.016: Q3.3 74.39,19.68
  Bottom 1.27: v66.9,15.11 71.98,15.11 | 74.39,19.68 71.98,17.27 71.98,15.11 | ATX_+12V.1 79,10.51 76.81,12.7 73.12,12.7 71.98,13.84 71.98,15.11
-12V  (via drill 0.5)
  Top 0.406: 92.17,22.12 Q4.3 | 75,11.59 68.81,17.78 39.85,17.78 33.88,23.75 v33.88,25.4
  Top 1.016: 75,11.59 ATX_-12V.1
  Top 1.27: -12V_OUT.1 ATX_-12V.1 75,12.04 82.09,12.04 92.17,22.12 | Q4.3 92.17,35.66 Q2.3
  Bottom 0.406: Q4.3 92.17,25.3 90.07,27.41 86.89,27.41 IC4.11 | 33.82,25.46 v33.88,25.4 31.02,25.4 30.96,25.46 30.39,26.04 IC5.11
DMM1
  Bottom 0.406: IC1.34 39.34,88.52 38.64,89.22 37.82,90.04 31.85,96.01 DMM1.1
DMM1_NEG  (1 unrouted)
DMM2
  Bottom 0.406: DMM2.1 41.88,94.61 IC1.33
DMM2_NEG  (1 unrouted)
ENC_A
  Bottom 0.406: SV2.2 71.75,93.73 75,90.47 75,85.57 73.12,83.69 68.17,83.69 62.2,77.72 IC1.16
ENC_B
  Bottom 0.406: SV2.1 72.11,96.27 76.5,91.87 76.5,84.45 72.95,80.9 68.68,80.9 64.74,76.96 IC1.17
ENC_PB
  Bottom 0.406: IC1.18 67.28,76.33 69.82,78.87 74.01,78.87 78.71,83.57 78.71,93.34 74.39,97.66 65.38,97.66 64.49,96.77 SV2.3
GND  (via drill 0.5, 1)  (2 unrouted)
  Top 0.406: SV1.10 31.75,61.72 38.02,68 38.02,73.74 39.52,75.23 48.66,75.23 49.5,74.4 IC1.11 49.5,69.72 46.2,66.42 LED2.C | 93.17,50.85 GND_OUT1.1
  Top 1.27: 93.17,50.85 96.03,47.98 v96.03,27.46 96.03,26.7 97.2,25.53 97.2,10.36 GND_OUT2.1 88.49,1.65 63,1.65 GND_1.1 | GND_1.1 ATX_GND.1 | GND_1.1 GND_3.1 GND_2.1 GND_4.1
  Bottom 0.305: 28.7,9.65 10.13,9.65 9.56,10.22 9.56,10.03 R46.2 | R45.2 10.41,19.3
  Bottom 0.406: 62.24,25.88 65.29,25.88 65.44,26.04 66.2,26.04 R2.1 C2.1 R10.1 C3.1 | 62.24,25.88 61.26,25.88 60.47,25.09 60.47,23.75 59.09,22.36 C1.1 | 62.24,25.88 IC2.12 | ATX_GND.1 63,10.53 59.09,14.44 C1.1 | 11.78,26.8 11.78,29.31 13.74,29.31 IC3.5 13.75,33.02 13.69,33.08 | 12.42,18.04 12.42,20.04 | 27.53,24.77 26.9,24.13 26.9,20.68 | 26.9,20.68 26.26,20.04 17.5,20.04 | 11.15,20.04 12.42,20.04 | 12.42,20.04 15.09,20.04 | 15.09,20.04 17.5,20.04 | 18.01,98.68 30.33,98.68 50.87,98.68 | 45.38,83.91 46.96,85.5 IC1.31 46.96,89.53 49.25,91.82 49.25,94.61 50.9,96.27 SV2.13 51.79,97.77 50.87,98.68 | 45.38,83.91 | 45.38,83.91 C8.1 44.52,81.57 44.52,79.48 49.58,74.42 | SV1.10 29.44,61.75 27.45,61.75 SV1.8 27.12,61.75 24.81,61.75 | 24.81,61.75 SV1.6 | C7.2 55.85,58.12 51.23,58.12 C6.2 50.9,58.12 50.06,58.12 48.94,59.23 48.94,68.4 49.5,68.96 IC1.11 49.58,71.98 49.58,74.42 | 49.58,74.42 49.58,75.95 50.87,77.24 | 50.87,77.24 50.9,77.27 C9.- | R12.1 95.66,29.08 96.03,28.71 v96.03,27.46 | IC3.7 11.78,26.8 | 24.81,61.75 24.79,61.72 SV1.4 20.72,60.38 20.72,53.65 18.64,51.56 11.91,51.56 11.48,51.13 11.48,33.08 13.69,33.08 | GND_DMM.1 16.74,98.68 18.01,98.68 | IC6.21 85.77,66.75 85.95,66.93 | 85.95,66.93 85.95,67.69 | 85.95,67.69 85.95,68.33 85.58,68.7 IC6.18 80.88,68.7 80.11,69.47 80.11,72.58 C11.2 | IC6.25 85.71,64.15 85.95,64.39 | 85.95,64.39 85.95,66.93 | IC6.26 85.82,63.5 85.95,63.63 85.95,64.39 | 85.95,67.69 86.03,67.77 X3.S1 92.43,74.93 | 92.43,74.93 X3.S2 92.4,79.83 U$2.P$2 | X3.4 92.32,75.04 92.43,74.93 | U$2.GND 92.38,83.8 U$2.P$2 | 92.4,93.98 U$2.P$4 92.38,96.95 U$2.P$3 84.99,98.68 50.87,98.68 | 92.4,93.98 U$2.P$2
  Bottom 0.406: U$2.P$11 U$2.P$9 92.35,94.03 92.4,93.98 | 50.87,77.24 53.31,74.8 60.42,74.8 60.93,74.3 60.93,69.4 64.24,66.1 73.76,66.1 | 73.76,66.1 IC6.7 | C10.2 73.76,66.1 | 18.01,98.68 18.01,94.61 19.1,93.52 | C5.1 16.74,33.08 13.69,33.08 | C1.1 59.09,19.81 59.95,18.95 67.69,18.95 70.84,22.1 70.84,24 71.47,24.64 R4.1 | 39.4,19.05 R24.1 43.98,19.24 45.12,20.38 45.12,24.77 R26.1 | 47.6,2.92 57.92,2.92 GND_3.1 | R18.1 17.5,20.04 | C4.1 11.15,20.04 | 13.61,18.04 12.42,18.04 | 26.9,20.68 27.56,20.68 31.09,17.14 36.39,17.14 37.23,17.99 | 12.42,18.04 9.89,18.04 9.56,17.72 | 11.78,26.8 11.78,24.77 12.29,24.26 14.96,24.26 15.09,24.13 15.09,20.04 | 10.41,19.3 11.15,20.04 | R43.2 v10.13,69.98 R44.2
  Bottom 1.27: GND_OUT3.1 55,18 GND_4.1
  pour Bottom (isolate 0.61): -0.28,-0.38 100.3,-0.38 100.3,99.82 -0.28,99.82
  pour Top (isolate 0.61): -0.03,0 100.05,0 100.05,99.95 -0.03,99.95
IO_EXP_INT  (1 unrouted)
KEY_C1
  Bottom 0.406: IC1.22 69.82,88.9 67.03,91.69 66.01,91.69 64.49,93.22 SV2.4
KEY_C2
  Bottom 0.406: SV2.5 63.24,94.97 63.24,92.48 67.21,88.52 67.21,87.14 IC1.23
KEY_C3
  Bottom 0.406: SV2.6 61.95,91.82 64.74,89.03 IC1.24
KEY_C4
  Bottom 0.406: SV2.7 60.7,94.97 60.7,90.58 62.13,89.15 62.13,87.17 IC1.25
KEY_R1
  Bottom 0.406: IC1.26 59.66,89.15 59.41,89.41 SV2.8
KEY_R2
  Bottom 0.406: SV2.9 58.14,95 58.14,90.04 57.12,89.03 IC1.27
KEY_R3
  Bottom 0.406: IC1.28 54.58,89.28 56.87,91.57 SV2.10
KEY_R4
  Bottom 0.406: IC1.29 52.22,87.17 52.22,89.81 55.65,93.24 55.65,94.97 54.53,96.09 SV2.11
LCD_DC
  Bottom 0.406: IC1.1 22.2,69.98 R40.2
MISO  (2 unrouted)
  Top 0.406: IC1.7 39.34,64.44 34.08,59.18 SV1.9
MOSI  (via drill 0.5)  (2 unrouted)
  Top 0.406: SV1.1 19.45,59.26 v13.2,59.26 | v53.21,49.1 53.21,75.39 51.43,77.17 39.19,77.17 36.78,74.75 36.78,71.91 IC1.6 | v7.59,32.13 7.47,32 v7.47,17.27
  Bottom 0.406: 9.24,32.13 9.24,57.33 11.17,59.26 v13.2,59.26 | 9.24,32.13 9.24,30.03 IC3.4 | v53.21,49.1 53.21,48.72 58.9,43.03 58.9,28.96 58.42,28.47 57.07,28.47 IC2.5 | SV1.1 18.9,59.18 17.57,60.5 17.57,63.35 19.51,65.28 32.48,65.28 36.8,69.6 IC1.6 | v7.59,32.13 9.24,32.13 | R42.2 v7.47,17.27
MOSI_3V3  (1 unrouted)
  Bottom 0.305: R46.1 9.5,8 9.12,7.62
  Bottom 0.406: R42.1 7.47,9.27 9.12,7.62 10.77,5.97
N$1
  Bottom 0.406: R1.1 IC2.14
N$2
  Bottom 0.406: R1.2 65.38,20.7 66.77,22.1 R2.2 C2.2 69.76,24.7 71.22,26.16 IC4.3
N$3
  Bottom 0.406: R4.2 74.2,22.87 74.17,22.95 74.17,22.52 R3.2 74.55,22.82 74.55,22.66 76.67,22.66 R5.1
N$4
  Bottom 0.406: R5.2 76.78,24.64 78.94,24.64 R6.1 79.39,24.89 IC4.2
N$5
  Bottom 0.406: Q1.2 71.37,35.59 76.93,35.59 78.71,33.81 R7.1 78.97,32.03 80.62,32.03 81.28,31.37 IC4.7 81.61,31.37 88.54,38.3 89.2,38.3 Q2.2
N$6
  Bottom 0.406: R6.2 78.98,22.66 80.49,22.66 81.28,23.44 IC4.1 81.47,23.65 82.47,23.65 83.26,24.43 83.26,28.12 82.65,28.73 81.61,28.73 IC4.5
N$7
  Top 0.406: 74.01,37.97 Q1.1 | 91.84,40.62 Q2.1 | 83.26,35.99 R8.1
  Top 1.27: 74.01,37.97 80.95,37.97 83.03,35.89 R8.1 | 91.84,40.62 87.88,40.62 83.26,35.99
  Bottom 0.406: IC4.6 81.39,29.92 79.1,29.92 R7.2 76.87,30.29 76.43,30.73 76.43,32.77 74.85,34.34 69.95,34.34 69.29,35 69.29,37.39 69.87,37.97 73.68,37.97 Q1.1
N$8
  Bottom 0.406: R13.1 91.44,32.36 93.74,32.36 R11.2 93.75,32.37 93.75,30.11 R12.2
N$9
  Bottom 0.406: R13.2 91.11,30.38 89.2,30.38 R14.1 88.87,30.05 86.89,30.05 IC4.9
N$10
  Bottom 0.406: IC4.10 86.89,28.73 91.16,28.73 94.31,25.58 97.25,25.58 97.99,26.31 97.99,38.73 94.18,42.55 72.44,42.55 67.72,37.83 R9.2 67.72,32.95 66.77,32 C3.2 R10.2
N$11
  Bottom 0.406: R14.2 88.87,32.03 87.55,32.03 86.89,31.37 IC4.8 86.61,31.17 85.44,31.17 84.91,30.63 84.91,26.44 85.19,26.16 IC4.12
N$12
  Bottom 0.406: IC2.10 62.28,28.47 63.7,28.47 64.36,29.13 64.36,32.45 R9.1
N$13
  Bottom 0.406: Q3.2 79.17,17.27 85.52,23.62 IC4.14 86.77,23.62 86.77,22.66 89.11,22.66 R15.1 89.13,21.01 90.32,19.81 Q4.2
N$14
  Top 1.27: Q3.1 79.47,14.73 R16.1
  Bottom 0.406: IC4.13 88.7,24.89 R15.2 89.2,24.43 90.29,24.43 90.6,24.13 90.6,21.79 91.26,21.13 96.42,21.13 97.03,20.52 97.03,18.21 96.06,17.25 92.2,17.25 Q4.1 | 84.25,19.15 R16.1
  Bottom 1.016: Q4.1 92.15,17.25
  Bottom 1.27: 92.15,17.25 86.15,17.25 84.25,19.15
N$15
  Bottom 0.406: IC3.8 16.92,25.53 R17.1
N$16
  Bottom 0.406: IC5.3 21.82,24.77 18.58,28 R17.2 C5.2
N$17
  Bottom 0.406: IC5.2 23.49,23.52 20.29,23.52 R19.1 17.62,23.68 R18.2
N$18
  Top 1.016: Q5.G 16.23,41.88
  Top 1.27: 16.23,41.88 32.38,41.88 R22.1
  Bottom 0.406: IC5.6 25.75,28.57 25.88,28.7 25.88,32.64 29.94,36.7 31.4,36.7 | R22.1 31.4,36.7 | 31.4,36.7 R23.2
N$19
  Bottom 0.406: R19.2 20.29,21.87 21,21.87 21.36,22.23 IC5.1 23.82,22.2 25.32,22.2 25.73,22.61 25.73,26.87 25.32,27.28 23.79,27.28 IC5.5
N$20
  Bottom 0.406: Q6.1 Q5.T1
N$21  (1 unrouted)
  Bottom 0.406: R44.1 R40.1
N$22
  Bottom 1.27: R21.2 R25.2 50.46,32.83 OUT3.1
N$23
  Bottom 0.406: R23.1 27.02,30.55 27.02,28.83 27.28,28.57 IC5.9 29.01,28.55 32.97,28.55 Q7.E
N$24
  Bottom 0.406: C7.1 55.85,63.73 Q8.1 54.58,65.15 IC1.13
N$25
  Bottom 0.406: Q7.B 37.26,32.31 32.94,32.31 30.5,29.87 28.98,29.87 28.99,29.87 IC5.8
N$26
  Bottom 0.406: C6.1 50.9,60.1 Q8.2 52.04,65.15 IC1.12
N$28
  Bottom 0.406: IC6.17 81.63,69.35 81,69.98 81,72.01 81.63,72.64 83.79,72.64 83.79,74.23 C11.1
N$29
  Bottom 0.406: IC6.16 82.5,70 81.89,70.61 81.89,71.25 82.14,71.5 85.79,71.5 86.83,72.54 X3.2
N$30
  Bottom 0.406: IC6.15 89.16,70.65 89.72,71.2 X3.3
N$31
  Top 0.406: 84.25,4.29 R16.2
  Top 1.27: 84.25,4.29 85.55,4.29 89.76,8.51 OUT2.1
N$32
  Top 0.406: 83.26,51.18 R8.2 | 86.56,51.18 OUT1.1
  Top 1.27: 86.56,51.18 83.26,51.18
N$33  (via drill 0.5)
  Top 0.406: v82.78,59.82 74.39,59.82 73.81,59.24 LED1.4
  Bottom 0.406: IC6.23 82.56,65.45 82.01,64.9 82.01,60.58 v82.78,59.82
N$34  (via drill 0.5)
  Top 0.406: v80.87,56.64 80.84,56.61 LED1.1
  Bottom 0.406: IC6.22 81.82,66.1 80.87,65.15 v80.87,56.64
N$35
  Top 0.406: LED1.3 73.81,49.27 R31.1
N$36
  Top 0.406: LED1.2 77.51,49.32 R32.1
N$37
  Top 0.406: LED2.A R33.1
N$38
  Bottom 0.406: Q6.2 26.9,35.81 23.79,32.71 IC5.7
N$39
  Bottom 0.406: IC5.10 34.01,27.3 35.02,28.32 39.47,28.32 40.87,29.72 40.87,49.4 R21.1
  Bottom 1.27: R21.1 R22.2
PS_CUR  (via drill 0.5)
  Top 0.406: IC1.40 24.15,86.84 24.15,78.61 25.35,77.42 25.35,66.04 25.93,65.46 25.93,56.08 39.62,42.39 39.62,35.71 38.33,34.42 36.29,34.42 Q7.C 34.57,33.53 33.17,32.13 33.17,28.55 35,26.72 v36.27,26.72
  Bottom 0.406: v36.27,26.72 38.28,26.72 39.6,25.4 R24.2
PS_VOLT  (via drill 0.5)
  Top 0.406: v54.91,41.4 64.56,41.4 65.78,42.62 65.78,62.87 58.49,70.16 58.49,77.17 53.87,81.79 34.9,81.79 32.48,84.2 27.53,84.2 26.64,85.09 IC1.39
  Bottom 0.406: 43.64,29.67 43.64,30.79 R25.1 | 43.64,29.67 43.64,28.42 R26.2 | v54.91,41.4 54.91,34.98 53.69,33.76 53.69,31.5 51.86,29.67 43.64,29.67
RST
  Bottom 0.406: IC1.9 44.3,71.65 33.07,60.43 25.8,60.43 24.81,59.44 SV1.5
SCK  (via drill 0.5)  (2 unrouted)
  Top 0.406: IC1.8 41.91,71.86 v41.91,61.42 | v26.08,53.39 26.08,48.97 21.18,44.07 13.94,44.07 7.34,37.47 v7.34,35.84
  Bottom 0.406: v26.08,53.39 26.08,54.76 27.15,55.83 SV1.7 27.15,57.76 28.01,56.9 40.76,56.9 41.91,58.04 | IC2.4 57.04,27.15 55.72,27.15 54.94,27.94 54.94,32.46 56.59,34.11 56.59,42.7 41.91,57.38 41.91,58.04 | 6.45,28.07 6.2,28.07 6.2,34.7 v7.34,35.84 | 6.45,28.07 IC3.3 | v41.91,61.42 41.91,58.04 | R41.2 6.32,27.94 6.45,28.07
SCK_3V3  (1 unrouted)
  Bottom 0.305: R45.1 8.17,19.18
  Bottom 0.406: R41.1 6.2,21.27 6.2,19.18 8.17,19.18
TS_IRQ  (1 unrouted)
USB_RX
  Bottom 0.406: IC6.1 63,62.2 57.12,68.07 IC1.14
USB_TX
  Bottom 0.406: IC1.15 59.66,68.2 63.06,64.8 IC6.5

### Text on the board
tPlace: GND | FrontPanel | USB / Power | USB / Data | ISP | PWR | USB / Status | TX | RX | GND | GND | GND | GND | GND | GND | 3V3 | 5V | -12V | +12V | PS_Fgen_HW / MainBoard / v1.2
bPlace: 1 | 1 | 1 | 1